# Altium schematic sheet power_supply.SchDoc: Board Power Supplies
size A3; Date: DO NOT USE, RATHER USE PROJ OPTIONS; DrawnBy: DO NOT USE, RATHER USE PROJ OPTIONS; Engineer: DO NOT USE, RATHER USE PROJ OPTIONS; Organization: DO NOT USE, RATHER USE PROJ OPTIONS; DocumentNumber: DO NOT USE, RATHER USE PROJ OPTIONS; Revision: DO NOT USE, RATHER USE PROJ OPTIONS; SheetNumber: 2; SheetTotal: 29; SCH_Sheet_Filename: power_supply.SchDoc; CurrentTime: DO NOT USE, RATHER USE PROJ OPTIONS; Time: DO NOT USE, RATHER USE PROJ OPTIONS; DocumentFullPathAndName: DO NOT USE, RATHER USE PROJ OPTIONS; DocumentName: DO NOT USE, RATHER USE PROJ OPTIONS; ModifiedDate: DO NOT USE, RATHER USE PROJ OPTIONS; ImagePath: DO NOT USE, RATHER USE PROJ OPTIONS
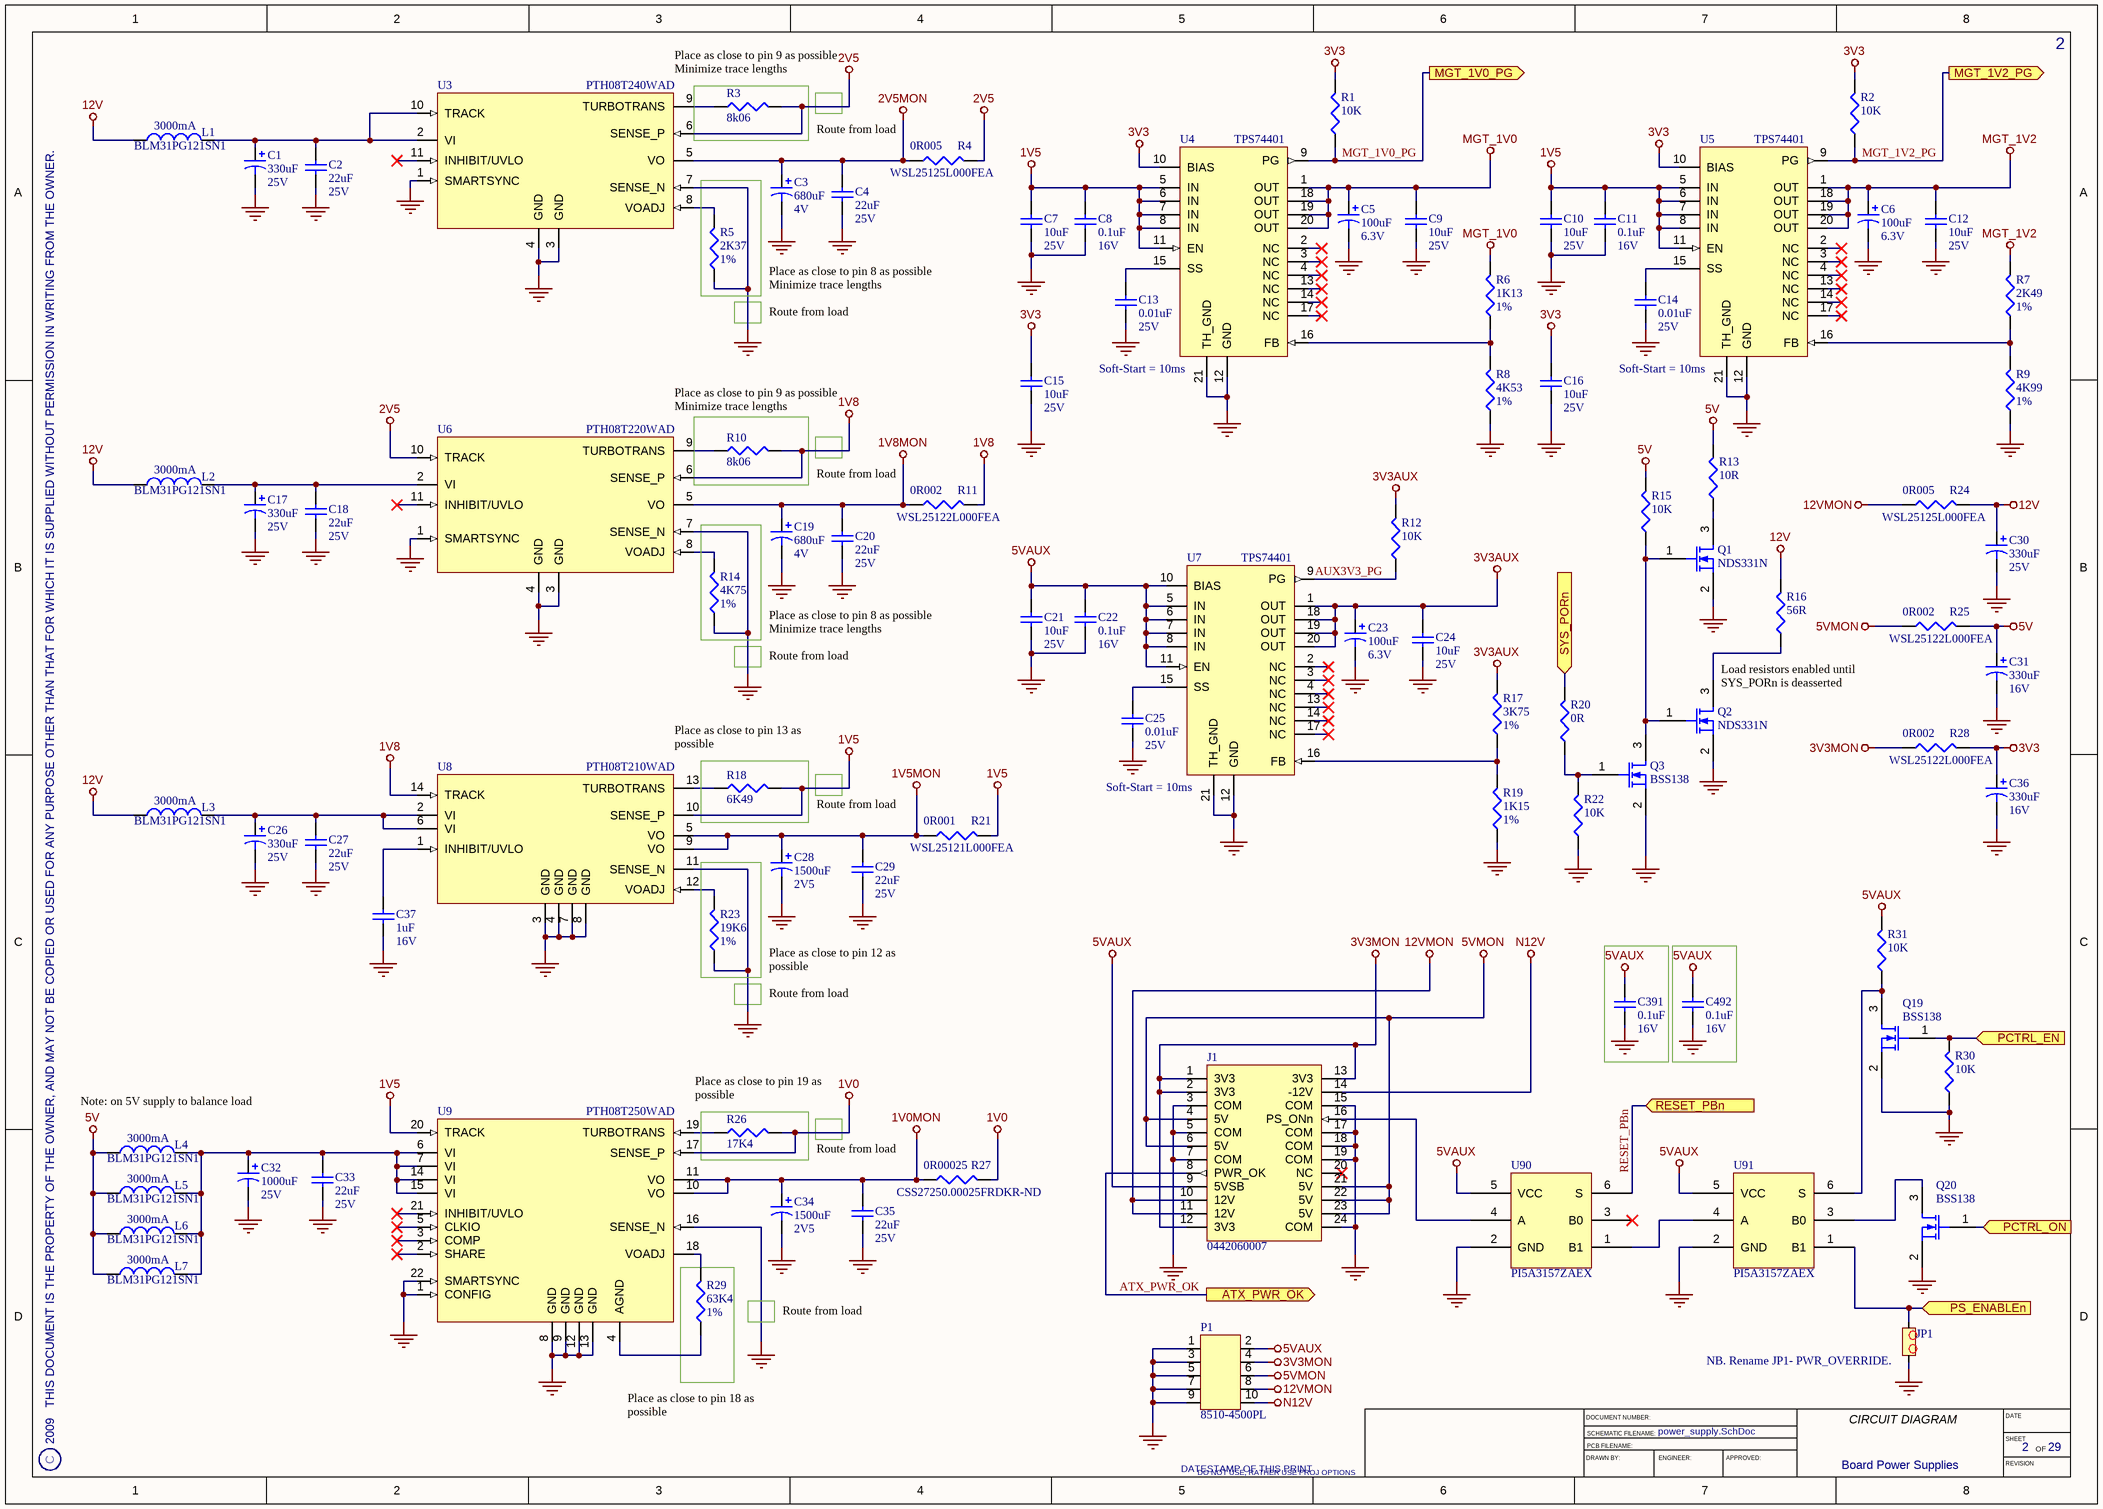
[diagram p0: power_supply.SchDoc]

## Parts
C1  Rating: 25V  [EEE1CA331UP]  (hidden comment: 330uF)
C2  Rating: 25V  [CAPC3225X270L]  (hidden comment: 22uF)
C3  Rating: 4V  [CAPMP7343X430L]  (hidden comment: 680uF)
C4  Rating: 25V  [CAPC3225X270L]  (hidden comment: 22uF)
C5  Rating: 6.3V  [CAPMP3528X210L]  (hidden comment: 100uF)
C6  Rating: 6.3V  [CAPMP3528X210L]  (hidden comment: 100uF)
C7  Rating: 25V  [CAPC3225X200L]  (hidden comment: 10uF)
C8  Rating: 16V  [CAPC1005X60L]  (hidden comment: 0.1uF)
C9  Rating: 25V  [CAPC3225X200L]  (hidden comment: 10uF)
C10  Rating: 25V  [CAPC3225X200L]  (hidden comment: 10uF)
C11  Rating: 16V  [CAPC1005X60L]  (hidden comment: 0.1uF)
C12  Rating: 25V  [CAPC3225X200L]  (hidden comment: 10uF)
C13  Rating: 25V  [CAPC1005X55L]  (hidden comment: 0.01uF)
C14  Rating: 25V  [CAPC1005X55L]  (hidden comment: 0.01uF)
C15  Rating: 25V  [CAPC3225X200L]  (hidden comment: 10uF)
C16  Rating: 25V  [CAPC3225X200L]  (hidden comment: 10uF)
C17  Rating: 25V  [EEE1CA331UP]  (hidden comment: 330uF)
C18  Rating: 25V  [CAPC3225X270L]  (hidden comment: 22uF)
C19  Rating: 4V  [CAPMP7343X430L]  (hidden comment: 680uF)
C20  Rating: 25V  [CAPC3225X270L]  (hidden comment: 22uF)
C21  Rating: 25V  [CAPC3225X200L]  (hidden comment: 10uF)
C22  Rating: 16V  [CAPC1005X60L]  (hidden comment: 0.1uF)
C23  Rating: 6.3V  [CAPMP3528X210L]  (hidden comment: 100uF)
C24  Rating: 25V  [CAPC3225X200L]  (hidden comment: 10uF)
C25  Rating: 25V  [CAPC1005X55L]  (hidden comment: 0.01uF)
C26  Rating: 25V  [EEE1CA331UP]  (hidden comment: 330uF)
C27  Rating: 25V  [CAPC3225X270L]  (hidden comment: 22uF)
C28  Rating: 2V5  [CAPMP7343X430L]  (hidden comment: 1500uF)
C29  Rating: 25V  [CAPC3225X270L]  (hidden comment: 22uF)
C30  Rating: 25V  [EEE1CA331UP]  (hidden comment: 330uF)
C31  Rating: 16V  [CAPMP7263X380L]  (hidden comment: 330uF)
C32  Rating: 25V  [CAPPRD750W80D1600H1500P]  (hidden comment: 1000uF)
C33  Rating: 25V  [CAPC3225X270L]  (hidden comment: 22uF)
C34  Rating: 2V5  [CAPMP7343X430L]  (hidden comment: 1500uF)
C35  Rating: 25V  [CAPC3225X270L]  (hidden comment: 22uF)
C36  Rating: 16V  [CAPMP7263X380L]  (hidden comment: 330uF)
C37  Rating: 16V  [CAPC2012X127L]  (hidden comment: 1uF)
C391  Rating: 16V  [CAPC1005X60L]  (hidden comment: 0.1uF)
C492  Rating: 16V  [CAPC1005X60L]  (hidden comment: 0.1uF)
J1  0442060007  [MOLEX_0442060007]
JP1  0022032021  [MOLEX_0022032021]  (value not drawn)
L1  Rating: 3000mA  PartNum: BLM31PG121SN1  [INDC3216X130L]  (hidden comment: 120R)
L2  Rating: 3000mA  PartNum: BLM31PG121SN1  [INDC3216X130L]  (hidden comment: 120R)
L3  Rating: 3000mA  PartNum: BLM31PG121SN1  [INDC3216X130L]  (hidden comment: 120R)
L4  Rating: 3000mA  PartNum: BLM31PG121SN1  [INDC3216X130L]  (hidden comment: 120R)
L5  Rating: 3000mA  PartNum: BLM31PG121SN1  [INDC3216X130L]  (hidden comment: 120R)
L6  Rating: 3000mA  PartNum: BLM31PG121SN1  [INDC3216X130L]  (hidden comment: 120R)
L7  Rating: 3000mA  PartNum: BLM31PG121SN1  [INDC3216X130L]  (hidden comment: 120R)
P1  8510-4500PL  [3M_8510-4500PL]
Q1  NDS331N  [SOT95P245X110-3N]
Q2  NDS331N  [SOT95P245X110-3N]
Q3  BSS138  [SOT95P245X110-3N]
Q19  BSS138  [SOT95P245X110-3N]
Q20  BSS138  [SOT95P245X110-3N]
R1  10K  [RESC1005X40L]
R2  10K  [RESC1005X40L]
R3  value 8k06  [RESC1005X40L]  (hidden comment: ResStd)
R4  PartNum: WSL25125L000FEA  [RESC6332X90M]  (hidden comment: 0R005)
R5  Tolerance: 1%  [RESC1005X40L]  (hidden comment: 2K37)
R6  Tolerance: 1%  [RESC1005X40L]  (hidden comment: 1K13)
R7  Tolerance: 1%  [RESC1005X40L]  (hidden comment: 2K49)
R8  Tolerance: 1%  [RESC1005X40L]  (hidden comment: 4K53)
R9  Tolerance: 1%  [RESC1005X40L]  (hidden comment: 4K99)
R10  value 8k06  [RESC1005X40L]  (hidden comment: ResStd)
R11  PartNum: WSL25122L000FEA  [RESC6332X90M]  (hidden comment: 0R002)
R12  10K  [RESC1005X40L]
R13  10R  [VISHAY_AC5]
R14  Tolerance: 1%  [RESC1005X40L]  (hidden comment: 4K75)
R15  10K  [RESC1005X40L]
R16  56R  [VISHAY_AC5]
R17  Tolerance: 1%  [RESC1005X40L]  (hidden comment: 3K75)
R18  value 6K49  [RESC1005X40L]  (hidden comment: ResStd)
R19  Tolerance: 1%  [RESC1005X40L]  (hidden comment: 1K15)
R20  0R  [RESC1005X40L]
R21  PartNum: WSL25121L000FEA  [RESC6332X90M]  (hidden comment: 0R001)
R22  10K  [RESC1005X40L]
R23  Tolerance: 1%  [RESC1005X40L]  (hidden comment: 19K6)
R24  PartNum: WSL25125L000FEA  [RESC6332X90M]  (hidden comment: 0R005)
R25  PartNum: WSL25122L000FEA  [RESC6332X90M]  (hidden comment: 0R002)
R26  value 17K4  [RESC1005X40L]  (hidden comment: ResStd)
R27  PartNum: CSS27250.00025FRDKR-ND  [RESC6867X140M]  (hidden comment: 0R00025)
R28  PartNum: WSL25122L000FEA  [RESC6332X90M]  (hidden comment: 0R002)
R29  Tolerance: 1%  [RESC1005X40L]  (hidden comment: 63K4)
R30  10K  [RESC1005X40L]
R31  10K  [RESC1005X40L]
U3  PTH08T240WAD  [DIP_Module_11PIN-A]
U4  TPS74401  [VQFN20]
U5  TPS74401  [VQFN20]
U6  PTH08T220WAD  [DIP_Module_11PIN]
U7  TPS74401  [VQFN20]
U8  PTH08T210WAD  [DIP_Module_14PIN]
U9  PTH08T250WAD  [DIP_Module_22PIN]
U90  PI5A3157ZAEX  [SC70-6]
U91  PI5A3157ZAEX  [SC70-6]

## Ports
ATX_PWR_OK (out), MGT_1V0_PG (out), MGT_1V2_PG (out), PCTRL_EN (in), PCTRL_ON (in), PS_ENABLEn (in), RESET_PBn (in), SYS_PORn (in)

## Nets
1V0: R26.2 R27.2 U9.17(SENSE_P)
1V0MON: C34.1 C35.2 R27.1 U9.10(VO) U9.11(VO)
1V5: C7.2 C8.2 C10.2 C11.2 R18.2 R21.2 U4.5(IN) U4.6(IN) U4.7(IN) U4.8(IN) U4.11(EN) U5.5(IN) U5.6(IN) U5.7(IN) U5.8(IN) U5.11(EN) U8.10(SENSE_P) U9.20(TRACK)
1V5MON: C28.1 C29.2 R21.1 U8.5(VO) U8.9(VO)
1V8: R10.2 R11.2 U6.6(SENSE_P) U8.14(TRACK)
1V8MON: C19.1 C20.2 R11.1 U6.5(VO)
2V5: R3.2 R4.2 U3.6(SENSE_P) U6.10(TRACK)
2V5MON: C3.1 C4.2 R4.1 U3.5(VO)
3V3: C15.2 C16.2 C36.1 R1.2 R2.2 R28.2 U4.10(BIAS) U5.10(BIAS)
3V3AUX: C23.1 C24.2 R12.2 R17.2 U7.1(OUT) U7.18(OUT) U7.19(OUT) U7.20(OUT)
3V3MON: J1.1(3V3) J1.2(3V3) J1.12(3V3) J1.13(3V3) P1.4 R28.1
5V: C31.1 L4.1 L5.1 L6.1 L7.1 R13.2 R15.2 R25.2
5VAUX: C21.2 C22.2 C391.2 C492.2 J1.9(5VSB) P1.2 R31.2 U7.5(IN) U7.6(IN) U7.7(IN) U7.8(IN) U7.10(BIAS) U7.11(EN) U90.5(VCC) U91.5(VCC)
5VMON: J1.4(5V) J1.6(5V) J1.21(5V) J1.22(5V) J1.23(5V) P1.6 R25.1
12V: C30.1 L1.1 L2.1 L3.1 R16.2 R24.2
12VMON: J1.10(12V) J1.11(12V) P1.8 R24.1
GND: C1.2 C2.1 C3.2 C4.1 C5.2 C6.2 C7.1 C8.1 C9.1 C10.1 C11.1 C12.1 C13.1 C14.1 C15.1 C16.1 C17.2 C18.1 C19.2 C20.1 C21.1 C22.1 C23.2 C24.1 C25.1 C26.2 C27.1 C28.2 C29.1 C30.2 C31.2 C32.2 C33.1 C34.2 C35.1 C36.2 C37.2 C391.1 C492.1 J1.3(COM) J1.5(COM) J1.7(COM) J1.15(COM) J1.17(COM) J1.18(COM) J1.19(COM) J1.24(COM) JP1.2 P1.1 P1.3 P1.5 P1.7 P1.9 Q1.2(S) Q2.2(S) Q3.2(S) Q19.2(S) Q20.2(S) R5.1 R8.1 R9.1 R14.1 R19.1 R22.1 R23.1 R30.1 U3.1(SMARTSYNC) U3.3(GND) U3.4(GND) U3.7(SENSE_N) U4.12(GND) U4.21(TH_GND) U5.12(GND) U5.21(TH_GND) U6.1(SMARTSYNC) U6.3(GND) U6.4(GND) U6.7(SENSE_N) U7.12(GND) U7.21(TH_GND) U8.3(GND) U8.4(GND) U8.7(GND) U8.8(GND) U8.11(SENSE_N) U9.1(CONFIG) U9.8(GND) U9.9(GND) U9.12(GND) U9.13(GND) U9.16(SENSE_N) U9.22(SMARTSYNC) U90.2(GND) U91.2(GND)
MGT_1V0: C5.1 C9.2 R6.2 U4.1(OUT) U4.18(OUT) U4.19(OUT) U4.20(OUT)
MGT_1V2: C6.1 C12.2 R7.2 U5.1(OUT) U5.18(OUT) U5.19(OUT) U5.20(OUT)
N12V: J1.14(-12V) P1.10
ATX_PWR_OK: J1.8(PWR_OK) ; port ATX_PWR_OK
AUX3V3_PG: R12.1 U7.9(PG)
MGT_1V0_PG: R1.1 U4.9(PG) ; port MGT_1V0_PG
MGT_1V2_PG: R2.1 U5.9(PG) ; port MGT_1V2_PG
PCTRL_EN: Q19.1(G) R30.2 ; port PCTRL_EN
PCTRL_ON: Q20.1(G) ; port PCTRL_ON
PS_ENABLEn: JP1.1 U91.1(B1) ; port PS_ENABLEn
RESET_PBn: U90.6(S) ; port RESET_PBn
SYS_PORn: R20.2 ; port SYS_PORn
NetC1_1: C1.1 C2.2 L1.2 U3.2(VI) U3.10(TRACK)
NetC13_2: C13.2 U4.15(SS)
NetC14_2: C14.2 U5.15(SS)
NetC17_1: C17.1 C18.2 L2.2 U6.2(VI)
NetC25_2: C25.2 U7.15(SS)
NetC26_1: C26.1 C27.2 L3.2 U8.2(VI) U8.6(VI)
NetC32_1: C32.1 C33.2 L4.2 L5.2 L6.2 L7.2 U9.6(VI) U9.7(VI) U9.14(VI) U9.15(VI)
NetC37_1: C37.1 U8.1(INHIBIT/UVLO)
NetJ1_16: J1.16(PS_ONn) U90.4(A)
NetQ1_1: Q1.1(G) Q2.1(G) Q3.3(D) R15.1
NetQ1_3: Q1.3(D) R13.1
NetQ2_3: Q2.3(D) R16.1
NetQ3_1: Q3.1(G) R20.1 R22.2
NetQ19_3: Q19.3(D) R31.1 U91.6(S)
NetQ20_3: Q20.3(D) U91.3(B0)
NetR3_1: R3.1 U3.9(TURBOTRANS)
NetR5_2: R5.2 U3.8(VOADJ)
NetR6_1: R6.1 R8.2 U4.16(FB)
NetR7_1: R7.1 R9.2 U5.16(FB)
NetR10_1: R10.1 U6.9(TURBOTRANS)
NetR14_2: R14.2 U6.8(VOADJ)
NetR17_1: R17.1 R19.2 U7.16(FB)
NetR18_1: R18.1 U8.13(TURBOTRANS)
NetR23_2: R23.2 U8.12(VOADJ)
NetR26_1: R26.1 U9.19(TURBOTRANS)
NetR29_1: R29.1 U9.4(AGND)
NetR29_2: R29.2 U9.18(VOADJ)
NetU90_1: U90.1(B1) U91.4(A)

Not connected (* = marked no-connect by the designer): J1 20(NC)*; U3 11(INHIBIT/UVLO)*; U4 2(NC)* 3(NC)* 4(NC)* 13(NC)* 14(NC)* 17(NC)*; U5 2(NC)* 3(NC)* 4(NC)* 13(NC)* 14(NC)* 17(NC)*; U6 11(INHIBIT/UVLO)*; U7 2(NC)* 3(NC)* 4(NC)* 13(NC)* 14(NC)* 17(NC)*; U9 2(SHARE)* 3(COMP)* 5(CLKIO)* 21(INHIBIT/UVLO)*; U90 3(B0)*

## Notes on the sheet
- Place as close to pin 9 as possible
  Minimize trace lengths
- Route from load
- Place as close to pin 8 as possible
  Minimize trace lengths
- (near U4) Soft-Start = 10ms
- (near U5) Soft-Start = 10ms
- (near Q2) Load resistors enabled until SYS_PORn is deasserted
- Place as close to pin 13 as possible
  Minimize trace lengths
- (near U7) Soft-Start = 10ms
- Place as close to pin 12 as possible
  Minimize trace lengths
- Note: on 5V supply to balance load
- Place as close to pin 19 as possible
  Minimize trace lengths
- (near JP1) NB. Rename JP1- PWR_OVERRIDE.
- Place as close to pin 18 as possible
  Minimize trace lengths
- 2009   THIS DOCUMENT IS THE PROPERTY OF THE OWNER, AND MAY NOT BE COPIED OR USED FOR ANY PURPOSE OTHER THAN THAT FOR WHICH IT IS SUPPLIED WITHOUT PERMISSION IN WRITING FROM THE OWNER.
- C
- DATESTAMP OF THIS PRINT
- DRAWN BY:
- DOCUMENT NUMBER:
- SCHEMATIC FILENAME:
- PCB FILENAME:
- ENGINEER:
- APPROVED:
- CIRCUIT DIAGRAM
- DATE
- SHEET
- REVISION
- OF

## Library data of the parts
C1 C17 C26 C30 = CAP-ELC-1: 330uF, Surface Mount, Radial, Aluminium Electrolytic Capacitor; Manufacturer: PANASONIC-ECG; PartNum: EEE1EA331UP; Tolerance: 20%; POD number: CAP-ELC-1; Value: 330uF; RoHS: Y; Sort Value: 330; Category: Capacitors; Subcategory: Electrolytic
C2 C4 C18 C20 C27 C29 C33 C35 = CAP-CER-9: 22uF, Ceramic Capacitor; Manufacturer: MURATA; PartNum: GRM32ER61E226ME15L; Tolerance: 20%; Dielectric: X5R; POD number: CAP-CER-9; Value: 22uF; RoHS: Y; Sort Value: 22; Category: Capacitors; Subcategory: Ceramic
C3 C19 = CAP-TAN-8: 680uF, Conductive Polymer Chip Capacitor; Manufacturer: KEMET; PartNum: T520Y687M004ATE015; Tolerance: 20%; ESR: 0.015; POD number: CAP-TAN-8; Value: 680uF; RoHS: Y; Sort Value: 680; Category: Capacitors; Subcategory: Tantalum
C5 C6 C23 = CAP-TAN-6: 100uF, Low ESR, Tantalum Capacitor; Manufacturer: AVX; PartNum: TPSB107M006R0200; Tolerance: 20%; ESR: 0.2; POD number: CAP-TAN-6; Value: 100uF; RoHS: Y; Sort Value: 100; Category: Capacitors; Subcategory: Tantalum
C7 C9 C10 C12 C15 C16 C21 C24 = CAP-CER-5: 10uF, Ceramic Capacitor; Manufacturer: MURATA; PartNum: GRM32DR61E106KA12L; Tolerance: 10%; Dielectric: X5R; POD number: CAP-CER-5; Value: 10uF; RoHS: Y; Sort Value: 100; Category: Capacitors; Subcategory: Ceramic
C8 C11 C22 C391 C492 = CAP-CER-1: 0.1uF, Ceramic Capacitor; Manufacturer: VENKEL; PartNum: C0402X7R160-104KN; Tolerance: 10%; Dielectric: X7R; POD number: CAP-CER-1; Value: 0.1uF; RoHS: Y; Sort Value: 0.1; Category: Capacitors; Subcategory: Ceramic
C13 C14 C25 = CAP-CER-6: 0.01uF, Ceramic Capacitor; Manufacturer: MURATA; PartNum: GRM155R71E103KA01D; Tolerance: 10%; Dielectric: X7R; POD number: CAP-CER-6; Value: 0.01uF; RoHS: Y; Sort Value: 0.01; Category: Capacitors; Subcategory: Ceramic
C28 C34 = CAP-TAN-4: 1500uF, Conductive Polymer Chip Capacitor; Manufacturer: KEMET; PartNum: T530X158M2R5ATE005; Tolerance: 20%; ESR: 0.005; POD number: CAP-TAN-4; Value: 1500uF; RoHS: Y; Sort Value: 1500; Category: Capacitors; Subcategory: Tantalum
C31 C36 = CAP-TAN-3: 330uF, Solid Tantalum Chip Capacitor; Manufacturer: VISHAY; PartNum: 594D337X0016R2T; Tolerance: 20%; ESR: 0.055; POD number: CAP-TAN-3; Value: 330uF; RoHS: Y; Sort Value: 330; Category: Capacitors; Subcategory: Tantalum
C32 = CAP-ELC-0: 1000uF, Aluminium Electrolytic Capacitor; Manufacturer: PANASONIC-ECG; PartNum: EEUFC1E102S; Tolerance: 20%; POD number: CAP-ELC-0; Value: 1000uF; RoHS: Y; Sort Value: 1000; Category: Capacitors; Subcategory: Electrolytic
C37 = CAP-CER-8: 1uF, Ceramic Capacitor; Manufacturer: MURATA; PartNum: GRM21BR61C105KA01L; Tolerance: 10%; Dielectric: X5R; POD number: CAP-CER-8; RoHS: Y; Value: 1uF; Sort Value: 100; Category: Capacitors; Subcategory: Ceramic
J1 = CONN-PCB-5: 24-Pin ATX Connector; Manufacturer: Molex; POD number: CONN-PCB-5; PartNum: 0442060007; RoHS: Y; Category: CONN; Subcategory: PCB
JP1 = CONN-PCB-14: 1x2, 2.56mm, Header/Jumper; Manufacturer: Molex; POD number: CONN-PCB-14; PartNum: 0022032021; RoHS: Y; Category: CONN; Subcategory: PCB
L1-L7 = IND-FB-1: 120 Ohm, Chip Ferrite Brad; Manufacturer: Murata; DC Res: 0.025R; Tolerance: 25%; POD number: IND-FB-1; RoHS: Y; Value: 120R; Sort Value: 120; Category: Inductors; Subcategory: FerriteBead
P1 = CONN-PCB-13: 2x5, 2.54 mm Pitch, Through-hole, 1 Amp, Female Header; Manufacturer: 3M; POD number: CONN-PCB-13; PartNum: 8510-4500PL; RoHS: Y; Category: CONN; Subcategory: PCB
Q1 Q2 = TRANS-NFET-1: N-Channel Logic Level Enhancement Mode Field Effect Transistor; Manufacturer: Fairchild Semiconductor; Rating: 1.3A; POD number: TRANS-NFET-1; PartNum: NDS331N; RoHS: Y; Category: TRANS; Subcategory: NFET
Q3 Q19 Q20 = TRANS-NFET-0: N-Channel Logic Level Enhancement Mode Field Effect Transistor; Manufacturer: Fairchild Semiconductor; Rating: 0.22A; POD number: TRANS-NFET-0; PartNum: BSS138; RoHS: Y; Category: TRANS; Subcategory: NFET
R1 R2 R12 R15 R22 R30 R31 = RES-TF-5: 10K, 1.1mm x 0.5mm, Thick Film Resistor; Manufacturer: ROYALOHM; PartNum: 0402WGJ0103T1E; Tolerance: 5%; Rating: 0.0625W; POD number: RES-TF-5; Value: 10K; Sort Value: 10000; Category: Resistors; Subcategory: ThickFilm; HelpURL: *.pdf
R3 R10 = RES-TF-43: 8K06, 1.1mm x 0.5mm, Thick Film Resistor; POD number: RES-TF-43
R4 R24 = RES-MS-0: 5 milliohm, Power Metal Strip, Sense Resistor; Manufacturer: VISHAY; Tolerance: 1%; Rating: 1W; POD number: RES-MS-0; Value: 0R005; Sort Value: 0.005; Category: Resistors; Subcategory: MetalStrip
R5 = RES-TF-34: 2K37, 1.1mm x 0.5mm, Thick Film Resistor; Manufacturer: ROYALOHM; PartNum: 0402WGF2371T1E; Rating: 0.0625W; POD number: RES-TF-34; Value: 2K37; Sort Value: 2370; Category: Resistors; Subcategory: ThickFilm; HelpURL: *.pdf
R6 = RES-TF-35: 1K13, 1.1mm x 0.5mm, Thick Film Resistor; Manufacturer: ROYALOHM; PartNum: 0402WGF1131T1E; Rating: 0.0625W; POD number: RES-TF-35; Value: 1K13; Sort Value: 1130; Category: Resistors; Subcategory: ThickFilm; HelpURL: *.pdf
R7 = RES-TF-36: 2K49, 1.1mm x 0.5mm, Thick Film Resistor; Manufacturer: ROYALOHM; PartNum: 0402WGF2K49T1E; Rating: 0.0625W; POD number: RES-TF-36; Value: 2K49; Sort Value: 2490; Category: Resistors; Subcategory: ThickFilm; HelpURL: *.pdf
R8 = RES-TF-37: 4K53, 1.1mm x 0.5mm, Thick Film Resistor; Manufacturer: ROYALOHM; PartNum: 0402WGF4531T1E; Rating: 0.0625W; POD number: RES-TF-37; Value: 4K53; Sort Value: 4530; Category: Resistors; Subcategory: ThickFilm; HelpURL: *.pdf
R9 = RES-TF-13: 4K99, 1.1mm x 0.5mm, Thick Film Resistor; Manufacturer: ROYALOHM; PartNum: 0402WGF4991T1E; Rating: 0.0625W; POD number: RES-TF-13; Value: 4K99; Sort Value: 4990; Category: Resistors; Subcategory: ThickFilm; HelpURL: *.pdf
R11 R25 R28 = RES-MS-1: 2 milliohm, Power Metal Strip, Sense Resistor; Manufacturer: VISHAY; Tolerance: 1%; Rating: 1W; POD number: RES-MS-1; Value: 0R002; Sort Value: 0.002; Category: Resistors; Subcategory: MetalStrip
R13 = RES-WW-0: 10R, Cemented Wire Round Resistor; Manufacturer: VISHAY; PartNum: AC05000001009JLB00; Tolerance: 5%; Rating: 5W; POD number: RES-WW-0; Value: 10R; Sort Value: 10; Category: Resistors; Subcategory: WireWound
R14 = RES-TF-23: 4K75, 1.1mm x 0.5mm, Thick Film Resistor; Manufacturer: ROYALOHM; PartNum: 0402WGF4751T1E; Rating: 0.0625W; POD number: RES-TF-23; Value: 4K75; Sort Value: 4750; Category: Resistors; Subcategory: ThickFilm; HelpURL: *.pdf
R16 = RES-WW-1: 56R, Cemented Wire Round Resistor; Manufacturer: VISHAY; PartNum: AC05000001009JLB00; Tolerance: 5%; Rating: 5W; POD number: RES-WW-1; Value: 56R; Sort Value: 56; Category: Resistors; Subcategory: WireWound
R17 = RES-TF-26: 3K57, 1.1mm x 0.5mm, Thick Film Resistor; Manufacturer: ROYALOHM; PartNum: 0402WGF3751T1E; Rating: 0.0625W; POD number: RES-TF-26; Value: 3K75; Sort Value: 3750; Category: Resistors; Subcategory: ThickFilm; HelpURL: *.pdf
R18 = RES-TF-44: 6K49, 1.1mm x 0.5mm, Thick Film Resistor; POD number: RES-TF-44
R19 = RES-TF-28: 1K15, 1.1mm x 0.5mm, Thick Film Resistor; Manufacturer: ROYALOHM; PartNum: 0402WGF1150T1E; Rating: 0.0625W; POD number: RES-TF-28; Value: 1K15; Sort Value: 1150; Category: Resistors; Subcategory: ThickFilm; HelpURL: *.pdf
R20 = RES-TF-0: 0R, 1.1mm x 0.5mm, Thick Film Resistor; Manufacturer: ROYALOHM; PartNum: 0402WG00000T1E; Tolerance: 0%; Rating: 0.0625W; POD number: RES-TF-0; Value: 0R; Sort Value: 0; Category: Resistors; Subcategory: ThickFilm; HelpURL: *.pdf
R21 = RES-MS-2: 1 milliohm, Power Metal Strip, Sense Resistor; Manufacturer: VISHAY; Tolerance: 1%; Rating: 1W; POD number: RES-MS-2; Value: 0R001; Sort Value: 0.001; Category: Resistors; Subcategory: MetalStrip
R23 = RES-TF-29: 19K6, 1.1mm x 0.5mm, Thick Film Resistor; Manufacturer: ROYALOHM; PartNum: 0402WGF1962T1E; Rating: 0.0625W; POD number: RES-TF-29; Value: 19K6; Sort Value: 19600; Category: Resistors; Subcategory: ThickFilm; HelpURL: *.pdf
R26 = RES-TF-30: 17K4, 1.1mm x 0.5mm, Thick Film Resistor; POD number: RES-TF-30
R27 = RES-MF-0: 0.25 milliohm, Power Metal Foil;, Sense Resistor; Manufacturer: STACKPOLE; Tolerance: 1%; Rating: 4W; POD number: RES-MF-0; Value: 0R00025; Sort Value: 0.00025; Category: Resistors; Subcategory: MetalFoil
R29 = RES-TF-33: 63K4, 1.1mm x 0.5mm, Thick Film Resistor; Manufacturer: ROYALOHM; PartNum: 0402WGF6342T1E; Rating: 0.0625W; POD number: RES-TF-33; Value: 63K4; Sort Value: 63400; Category: Resistors; Subcategory: ThickFilm; HelpURL: *.pdf
U3 = IC-REG-2: 10-A, 4.5-V to 14-V INPUT, NON-ISOLATED, WIDE-OUTPUT, ADJUSTABLE POWER MODULE WITH TurboTrans; Manufacturer: Texas Instruments; POD number: IC-REG-2; PartNum: PTH08T240WAD; RoHS: Y; Category: IC; Subcategory: Regulators
U4 U5 U7 = IC-REG-5: 3.0A Ultra-LDO with Programmable Soft-Start; Manufacturer: Texas Instruments; POD number: IC-REG-5; PartNum: TPS74401; RoHS: Y; Category: IC; Subcategory: Regulators
U6 = IC-REG-1: 16-A, 4.5-V to 14-V INPUT, NON-ISOLATED, WIDE-OUTPUT, ADJUSTABLE POWER MODULE WITH TurboTrans; Manufacturer: Texas Instruments; POD number: IC-REG-1; PartNum: PTH08T220WAD; RoHS: Y; Category: IC; Subcategory: Regulators
U8 = IC-REG-0: 30-A, 5.5V-14-V INPUT, NON-ISOLATED, WIDE OUTPUT ADJUST, POWER MODULE WITH TURBOTRANS; Manufacturer: Texas Instruments; POD number: IC-REG-0; PartNum: PTH08T210WAD; RoHS: Y; Category: IC; Subcategory: Regulators
U9 = IC-REG-3: 50-A, 4.5-V to 14-V INPUT, NON-ISOLATED,  WIDE-OUTPUT, ADJUSTABLE POWER MODULE WITH TurboTrans; Manufacturer: Texas Instruments; POD number: IC-REG-3; PartNum: PTH08T250WAD; RoHS: Y; Category: IC; Subcategory: Regulators
U90 U91 = IC-LOG-5: Low voltage SPDT Analogue Switch; Manufacturer: PERICOM; POD number: IC-LOG-5; PartNum: PI5A3157ZAEX; RoHS: Y; Category: IC; Subcategory: Logic